# Altium schematic sheet Powering.SchDoc
size A; SheetNumber: 3; SheetTotal: 7
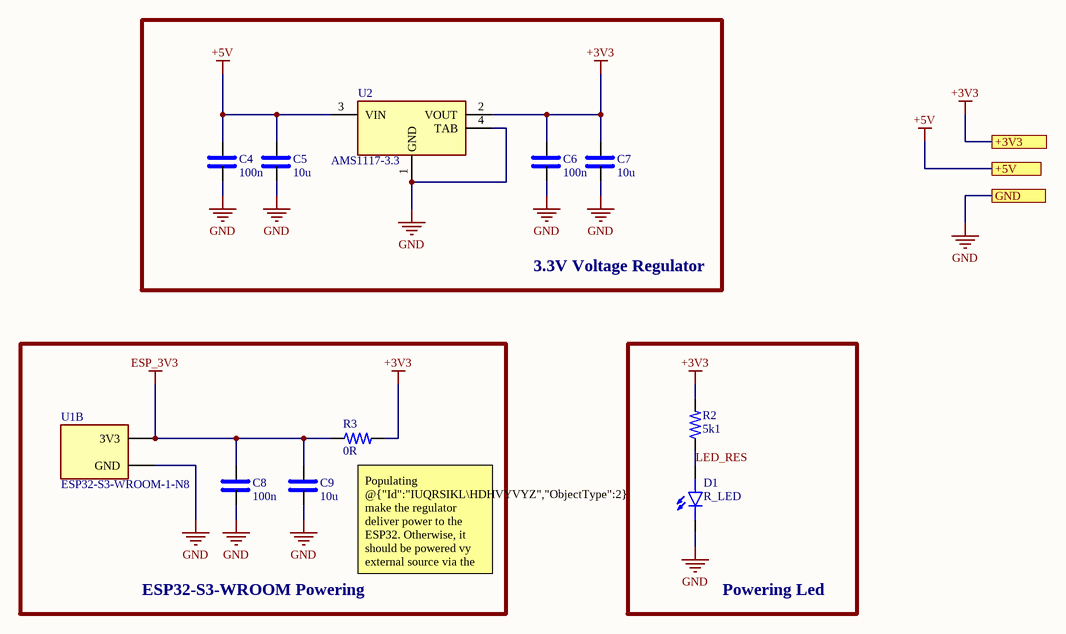
[diagram p0: Powering.SchDoc]

## Parts
C4  100n  [0402 CAP]
C5  10u  [FP-GCJ188-0_2-IPC_C]
C6  100n  [0402 CAP]
C7  10u  [FP-GCJ188-0_2-IPC_C]
C8  100n  [0402 CAP]
C9  10u  [FP-GCJ188-0_2-IPC_C]
D1  R_LED  [LEDC2012X70N]
R2  5k1  [0402 RES]
R3  0R  [0402 RES]
U1  ESP32-S3-WROOM-1-N8  [XCVR_ESP32-S3-WROOM-1-N8]  (part B of 2)
U2  AMS1117-3.3  [SOT229P700X180-4N]

## Blocks framed on the sheet
3.3V Voltage Regulator: C4-C7 U2
ESP32-S3-WROOM Powering: C8 C9 R3 U1
Powering Led: D1 R2

## Ports
+3V3 (see Master[2B]), +5V (see Master[2B]), GND (see Master[2B])

## Nets
+3V3: C6.2 C7.2 R2.2 R3.2 U2.2(VOUT) ; port +3V3
+5V: C4.2 C5.2 U2.3(VIN) ; port +5V
ESP_3V3: C8.2 C9.2 R3.1 U1.2(3V3)
GND: C4.1 C5.1 C6.1 C7.1 C8.1 C9.1 D1.C U1.1(GND) U2.1(GND) U2.4(TAB) ; port GND
LED_RES: D1.A R2.1

## Notes on the sheet
- (near R3) Populating @{"Id":"IUQRSIKL\HDHVYVYZ","ObjectType":2} make the regulator deliver power to the ESP32. Otherwise, it should be powered vy external source via the UI 3.3V pins.

## Library data of the parts
C4 C6 C8 = 0402 SMD Capacitor: Multilayer Ceramic Capacitor, 0.1 uF, 25 V, ï¿½ 10%, X7R, 0402 [1005 Metric]; Manufacturer: Samsung; Manufacturer Part Number: CL05B104KA5NNNC; Material: 4241ConductorMaterial; Value: 100nF; Voltage Rating: 25V; ComponentLink1Description: Link; ComponentLink1URL: *; Supplier: Digikey; Supplier Part Number: 1276-6720-1-ND; RoHS: Yes; Category: Ceramic Capacitors; Stock: 9938397; Pricing: 1=0.08, 10=0.006, 50=0.0056, 100=0.0048, 500=0.0044, 1000=0.004, 2500=0.0032 (USD); Mounting Technology: Surface Mount; Case/Package: 0402; Case Code (Metric): 1005; Case Code (Imperial): 0402; Min Operating Temperature: -55°C; Max Operating Temperature: 125°C; Packaging: Cut Tape; Tolerance: 10%; Series: CL; Voltage Rating (DC): 25V; Length: 0.039inch; Width: 0.02inch; Height: 550um; Thickness: 0.022inch; RoHS Compliant: Yes; ComponentLink2URL: https://datasheet.octopart.com/CL05B104KA5NNNC-Samsung-Electro-Mechanics-datasheet-116890910.pdf?src-supplier=Future+Electronics; ComponentLink2Description: https://datasheet.octopart.com/CL05B104KA5NNNC-Samsung-Electro-Mechanics-datasheet-116890910.pdf?src-supplier=Future+Electronics; ComponentLink3URL: http://www.samsungsem.com/kr/support/product-search/mlcc/CL05B104KA5NNNC.jsp?src-supplier=Digikey; ComponentLink3Description: http://www.samsungsem.com/kr/support/product-search/mlcc/CL05B104KA5NNNC.jsp?src-supplier=Digikey
C5 C7 C9 = 0603 SMD CAP: Multilayer Ceramic Capacitor, 10 uF, 25 V, ï¿½ 10%, X5R, 0603 [1608 Metric]; Manufacturer: Murata; Manufacturer Part Number: GRM188R61E106KA73D; Material: 4241ConductorMaterial; Dielectric: 1537DielectricType; Voltage Rating (DC): 25V; Supplier: Mouser; Supplier Part Number: 81-GRM188R61E106KA3D; RoHS: Yes; Category: Ceramic Capacitors; Stock: 343973; Pricing: 1=0.22, 10=0.073, 50=0.073, 100=0.054, 1000=0.05, 10000=0.038 (USD); Length: 1.6mm; Width: 800um; Height: 1mm; Thickness: 800um; ComponentLink1URL: https://datasheet.octopart.com/GRM188R61E106KA73D-Murata-datasheet-149523249.pdf?src-supplier=Newark; ComponentLink1Description: https://datasheet.octopart.com/GRM188R61E106KA73D-Murata-datasheet-149523249.pdf?src-supplier=Newark; ComponentLink2URL: https://search.murata.co.jp/Ceramy/image/img/A01X/G101/ENG/GRM188R61E106KA73-01.pdf?src-supplier=Digikey; ComponentLink2Description: https://search.murata.co.jp/Ceramy/image/img/A01X/G101/ENG/GRM188R61E106KA73-01.pdf?src-supplier=Digikey; ComponentLink3URL: https://datasheet.octopart.com/GRM188R61E106KA73D-Murata-datasheet-165579666.pdf?src-supplier=TME; ComponentLink3Description: https://datasheet.octopart.com/GRM188R61E106KA73D-Murata-datasheet-165579666.pdf?src-supplier=TME
D1 = 597-3305-607F: LED Uni-Color Red 2-Pin Chip 0805 T/R; Availability: Unavailable; Value: *; Price: None; MP: 597-3305-607F; Package: None
R2 = 0402 SMD Resistor: General Purpose Chip Resistor Thick Film 0402 5.1kOhm 1% Paper T/R; Manufacturer: Yageo; Manufacturer Part Number: RC0402FR-7W5K1L; Value: 5.1kR; Resistance: *; Part Number: *; ComponentLink1Description: Link; ComponentLink1URL: *; Tolerance: *; Wattage: *; Supplier: Digikey; Supplier Part Number: 13-RC0402FR-7W5K1LCT-ND; RoHS: Yes; Category: Chip SMD Resistors; Stock: 6352; Pricing: 1=0.1, 10=0.021, 50=0.0164, 100=0.0112, 500=0.00868, 1000=0.00612, 5000=0.0051 (USD); Case/Package: 343Case; Packaging: 10Packaging; RoHS Compliant: Yes
R3 = 0402 SMD Resistor: SMD Chip Resistor, Jumper, 0 ohm, 100 mW, 0402 [1005 Metric], Thick Film, General Purpose; Manufacturer: Panasonic; Manufacturer Part Number: ERJ-2GE0R00X; Value: 0mR; Power Rating: 100mW; Voltage Rating: 50V; Temperature Coefficient: 600ppm/°C; ComponentLink1Description: Link; ComponentLink1URL: *; Supplier: Mouser; Supplier Part Number: 667-ERJ-2GE0R00X; RoHS: Yes; Category: Chip SMD Resistors; Stock: 616486; Pricing: 1=0.1, 10=0.013, 50=0.013, 100=0.008, 1000=0.006, 10000=0.004 (USD); Mounting Technology: Surface Mount; Case/Package: 0402; Pins: 2NUMBER; Contact Plating: Tin; Case Code (Metric): 1005; Case Code (Imperial): 0402; Min Operating Temperature: -55°C; Max Operating Temperature: 155°C; Resistor Type: Thick Film; Packaging: Cut Tape; Package Quantity: 10000; Number of Terminations: 2; Termination: SMD/SMT; Max Power Dissipation: 100mW; Features: Automotive AEC-Q200; Series: ERJ; Construction: Rectangular; Technology: THICK FILM; Voltage Rating (DC): 50V; Length: 1mm; Width: 0.5mm; Height: 0.35mm; Depth: 0.5mm; Ratings: AEC-Q200; Radiation Hardening: No; Reach SVHC Compliant: No; Military Standard: Not; RoHS Compliant: Yes; Lead Free: 5697LeadFree; ComponentLink2URL: https://datasheet.ciiva.com/11821/0900766b80f806dd-11821176.pdf?src-supplier=Rs; ComponentLink2Description: https://datasheet.ciiva.com/11821/0900766b80f806dd-11821176.pdf?src-supplier=Rs; ComponentLink3URL: https://datasheet.ciiva.com/46389/1678796-46389518.pdf?src-supplier=Element14; ComponentLink3Description: https://datasheet.ciiva.com/46389/1678796-46389518.pdf?src-supplier=Element14; ComponentLink4URL: https://datasheet.ciiva.com/28695/1678796-28695758.pdf?src-supplier=Element14; ComponentLink4Description: https://datasheet.ciiva.com/28695/1678796-28695758.pdf?src-supplier=Element14; ComponentLink5URL: https://datasheet.ciiva.com/16778/70260739-16778335.pdf?src-supplier=Allied+Electronics; ComponentLink5Description: https://datasheet.ciiva.com/16778/70260739-16778335.pdf?src-supplier=Allied+Electronics; ComponentLink6URL: https://datasheet.ciiva.com/48531/aoa0000ce1-48531077.pdf?src-supplier=Avnet; ComponentLink6Description: https://datasheet.ciiva.com/48531/aoa0000ce1-48531077.pdf?src-supplier=Avnet; ComponentLink7URL: https://datasheet.ciiva.com/30097/4aoa0000ce1-30097116.pdf?src-supplier=Onlinecomponents.com; ComponentLink7Description: https://datasheet.ciiva.com/30097/4aoa0000ce1-30097116.pdf?src-supplier=Onlinecomponents.com; ComponentLink8URL: https://datasheet.ciiva.com/43460/1678796-43460347.pdf?src-supplier=Farnell; ComponentLink8Description: https://datasheet.ciiva.com/43460/1678796-43460347.pdf?src-supplier=Farnell; ComponentLink9URL: https://datasheet.ciiva.com/5959/1678796-5959692.pdf?src-supplier=Farnell; ComponentLink9Description: https://datasheet.ciiva.com/5959/1678796-5959692.pdf?src-supplier=Farnell; ComponentLink10URL: https://datasheet.ciiva.com/16783/70260739-16783734.pdf?src-supplier=Allied+Electronics; ComponentLink10Description: https://datasheet.ciiva.com/16783/70260739-16783734.pdf?src-supplier=Allied+Electronics
U1 = ESP32-S3-WROOM-1-N8: <a href="https://pricing.snapeda.com/parts/ESP32S3WROOM1N8R8/Espressif%20Systems/view-part?ref=eda">Check availability</a>  <a href="https://pricing.snapeda.com/parts/ESP32-S3-WROOM-1-N8R8/Espressif%20Systems/view-part?ref=eda">Check availability</a>; pin to pad: 1>1+40+41_1+41_2+41_3+41_4+41_5+41_6+41_7+41_8+41_9+41_10+41_11+41_12+41_13+41_14+41_15+41_16+41_17+41_18+41_19+41_20+41_21; MF: {'manufacturer': u'Espressif Systems'}; Package: None; Price: None; Value: *; MP: ESP32-S3-WROOM-1-N8; Availability: Unavailable
U2 = AMS1117-3.3: Sot223/Pkg 1-Amp 3.3-Volt Low Drop Out Voltage Regulatator; MF: Advanced Monolithic Systems; Package: SOT-223 Seeed Technology; Value: *; Check_prices: https://www.snapeda.com/parts/AMS1117-3.3/Advanced+Monolithic+Systems/view-part/?ref=eda; Price: None; Availability: Not in stock; MP: AMS1117-3.3; SnapEDA_Link: https://www.snapeda.com/parts/AMS1117-3.3/Advanced+Monolithic+Systems/view-part/?ref=snap